# Altium schematic sheet LEDs.SchDoc: Your title
size A4; Date: 2017/06/29; DrawnBy: 亓岳鑫; Revision: Alfa 0.1; SheetNumber: 4; SheetTotal: 6; Time: 19:01
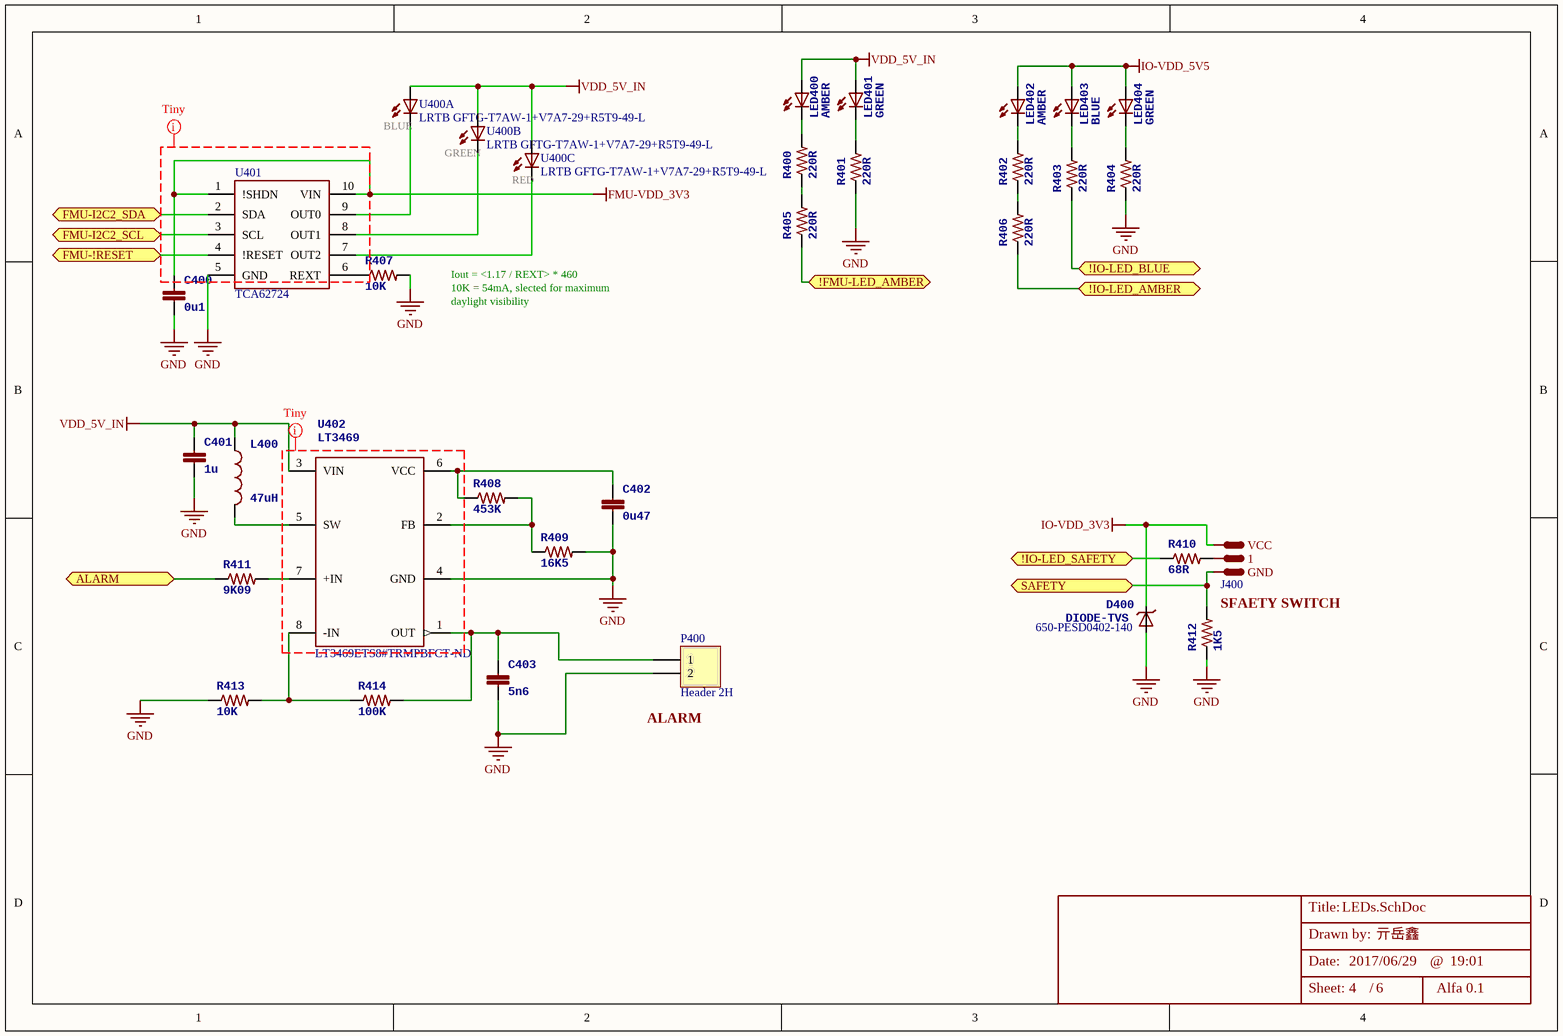
[diagram p0: LEDs.SchDoc]

## Parts
C400  0u1  [0603-CAP]
C401  1u  [0603-CAP]
C402  0u47  [0603-CAP]
C403  5n6  [0603-CAP]
D400  DIODE-TVS  Supplier Part Number 1: 650-PESD0402-140  [0402-TVS]
J400  HDR 3X1  [HDR3X1H]  (value not drawn)
L400  47uH  [0805-IND]
LED400  AMBER  [0603-LED]
LED401  GREEN  [0603-LED]
LED402  AMBER  [0603-LED]
LED403  BLUE  [0603-LED]
LED404  GREEN  [0603-LED]
P400  Header 2H  [HDR1X2H]
R400  220R  [0603-RES]
R401  220R  [0603-RES]
R402  220R  [0603-RES]
R403  220R  [0603-RES]
R404  220R  [0603-RES]
R405  220R  [0603-RES]
R406  220R  [0603-RES]
R407  10K  [0603-RES]
R408  453K  [0603-RES]
R409  16K5  [0603-RES]
R410  68R  [0603-RES]
R411  9K09  [0603-RES]
R412  1K5  [0603-RES]
R413  10K  [0603-RES]
R414  100K  [0603-RES]
U400  LRTB GFTG-T7AW-1+V7A7-29+R5T9-49-L  [P-LCC-6]  (parts A,B,C of 3)
U401  TCA62724  [SON10]
U402  LT3469  Supplier Part Number 1: LT3469ETS8#TRMPBFCT-ND  [SOT23-8]

## Ports
!FMU-LED_AMBER, !IO-LED_AMBER, !IO-LED_BLUE, !IO-LED_SAFETY, ALARM, FMU-!RESET, FMU-I2C2_SCL, FMU-I2C2_SDA, SAFETY

## Nets
FMU-VDD_3V3: C400.P$1 U401.1(!SHDN) U401.10(VIN)
GND: C400.P$2 C401.P$2 C402.P$2 C403.P$2 D400.A P400.2 R401.1 R404.1 R407.2 R409.2 R412.1 R413.1 U401.5(GND) U402.4(GND)
IO-VDD_3V3: D400.C J400.VCC
IO-VDD_5V5: LED402.A LED403.A LED404.A
VDD_5V_IN: C401.P$1 L400.P$1 LED400.A LED401.A U400.A1(A) U400.A2(A) U400.A3(A) U402.3(VIN)
!FMU-LED_AMBER: R405.1 ; port !FMU-LED_AMBER
!IO-LED_AMBER: R406.1 ; port !IO-LED_AMBER
!IO-LED_BLUE: R403.1 ; port !IO-LED_BLUE
!IO-LED_SAFETY: R410.1 ; port !IO-LED_SAFETY
ALARM: R411.1 ; port ALARM
FMU-!RESET: U401.4(!RESET) ; port FMU-!RESET
FMU-I2C2_SCL: U401.3(SCL) ; port FMU-I2C2_SCL
FMU-I2C2_SDA: U401.2(SDA) ; port FMU-I2C2_SDA
SAFETY: J400.GND R412.2 ; port SAFETY
NetC402_P$1: C402.P$1 R408.1 U402.6(VCC)
NetC403_P$1: C403.P$1 P400.1 R414.2 U402.1(OUT)
NetJ400_1: J400.1 R410.2
NetL400_P$2: L400.P$2 U402.5(SW)
NetLED400_C: LED400.C R400.2
NetLED401_C: LED401.C R401.2
NetLED402_C: LED402.C R402.2
NetLED403_C: LED403.C R403.2
NetLED404_C: LED404.C R404.2
NetR400_1: R400.1 R405.2
NetR402_1: R402.1 R406.2
NetR407_1: R407.1 U401.6(REXT)
NetR408_2: R408.2 R409.1 U402.2(FB)
NetR411_2: R411.2 U402.7(+IN)
NetR413_2: R413.2 R414.1 U402.8(-IN)
NetU400_C1: U400.C1(C) U401.9(OUT0)
NetU400_C2: U400.C2(C) U401.8(OUT1)
NetU400_C3: U400.C3(C) U401.7(OUT2)

## Layout directives
net class Tiny_componet: (no net found under the mark)

## Notes on the sheet
- Iout = <1.17 / REXT> * 460
- 10K = 54mA, slected for maximum
- daylight visibility
- SFAETY SWITCH
- (near P400) ALARM
- Title:
- Date:
- Drawn by:
- @
- Sheet:       /
- (in symbol MULTI-LEDS, part A) BLUE
- (in symbol MULTI-LEDS, part B) GREEN
- (in symbol MULTI-LEDS, part C) RED

## Library data of the parts
C400-C403 = CAP0603: CAP CER 2.2UF 16V 10% X6S 0603; PARTNO: C1608X6S1C225K080AC; 3DR_PARTNO: ECM0619; Supplier 1: Digi-Key; Supplier Part Number 1: 445-7438-1-ND
  C400: Value: 0u1
  C401: Value: 1u
  C402: Value: 0u47
  C403: Value: 5n6
D400 = DIODE-TVS: TVS DIODE 14VWM 40VC 0402; 3DR_PARTNO: ECM0837; PARTNO: PESD0402-140; Value: 40v; Supplier 1: Mouser
J400 = HDR 3X1: Header 3X1 pins
L400 = INDUCTOR0805: FIXED IND 47UH 170MA 4.81 OHM; PARTNO: MLZ2012M470W; 3DR_PARTNO: ECM0814; Supplier 1: Digi-Key; Supplier Part Number 1: 445-17079-1-ND; Value: 47UH
LED400-LED404 = LED0603: LED 1.6X0.8 DOME ORN CLEAR SMD; PARTNO: APTD1608SECK; 3DR_PARTNO: ECM0515; Supplier 1: Digi-Key; Supplier Part Number 1: 754-1802-1-ND
  LED400 LED402: Value: AMBER
  LED401 LED404: Value: GREEN
  LED403: Value: BLUE
P400 = Header 2H: Header, 2-Pin, Right Angle; LatestRevisionDate: 17-Jul-2002; LatestRevisionNote: Re-released for DXP Platform.; Publisher: Altium Limited
R400-R414 = RESISTOR0603-RES: RES 10 OHM 1/10W 5% 0603; PARTNO: RC1608J100CS; 3DR_PARTNO: ECM0811; Supplier 1: Digi-Key; Supplier Part Number 1: 1276-5014-1-ND
  R400-R406: Value: 220R
  R407 R413: Value: 10K
  R408: Value: 453K
  R409: Value: 16K5
  R410: Value: 68R
  R411: Value: 9K09
  R412: Value: 1K5
  R414: Value: 100K
U400 = MULTI-LEDS: Muti LEDs
U401 = TCA62724: 3-Channel Constant-Current LED Driver
U402 = LT3469: IC AMP DVR W/REG 1.3MHZ TSOT23-8; 3DR_PARTNO: ECM0829; Value: BUZZER; Supplier 1: Digi-Key